# EasyEDA Pro project TC264_2024-10-17.epro

# Schematic Schematic2
Create Date: 2023-09-19; Page Name: P1; Project Name: TC264-摄像头组别-售卖; Schematic Name: Schematic2; Update Date: 2023-12-20; Add into BOM: yes; Convert to PCB: yes
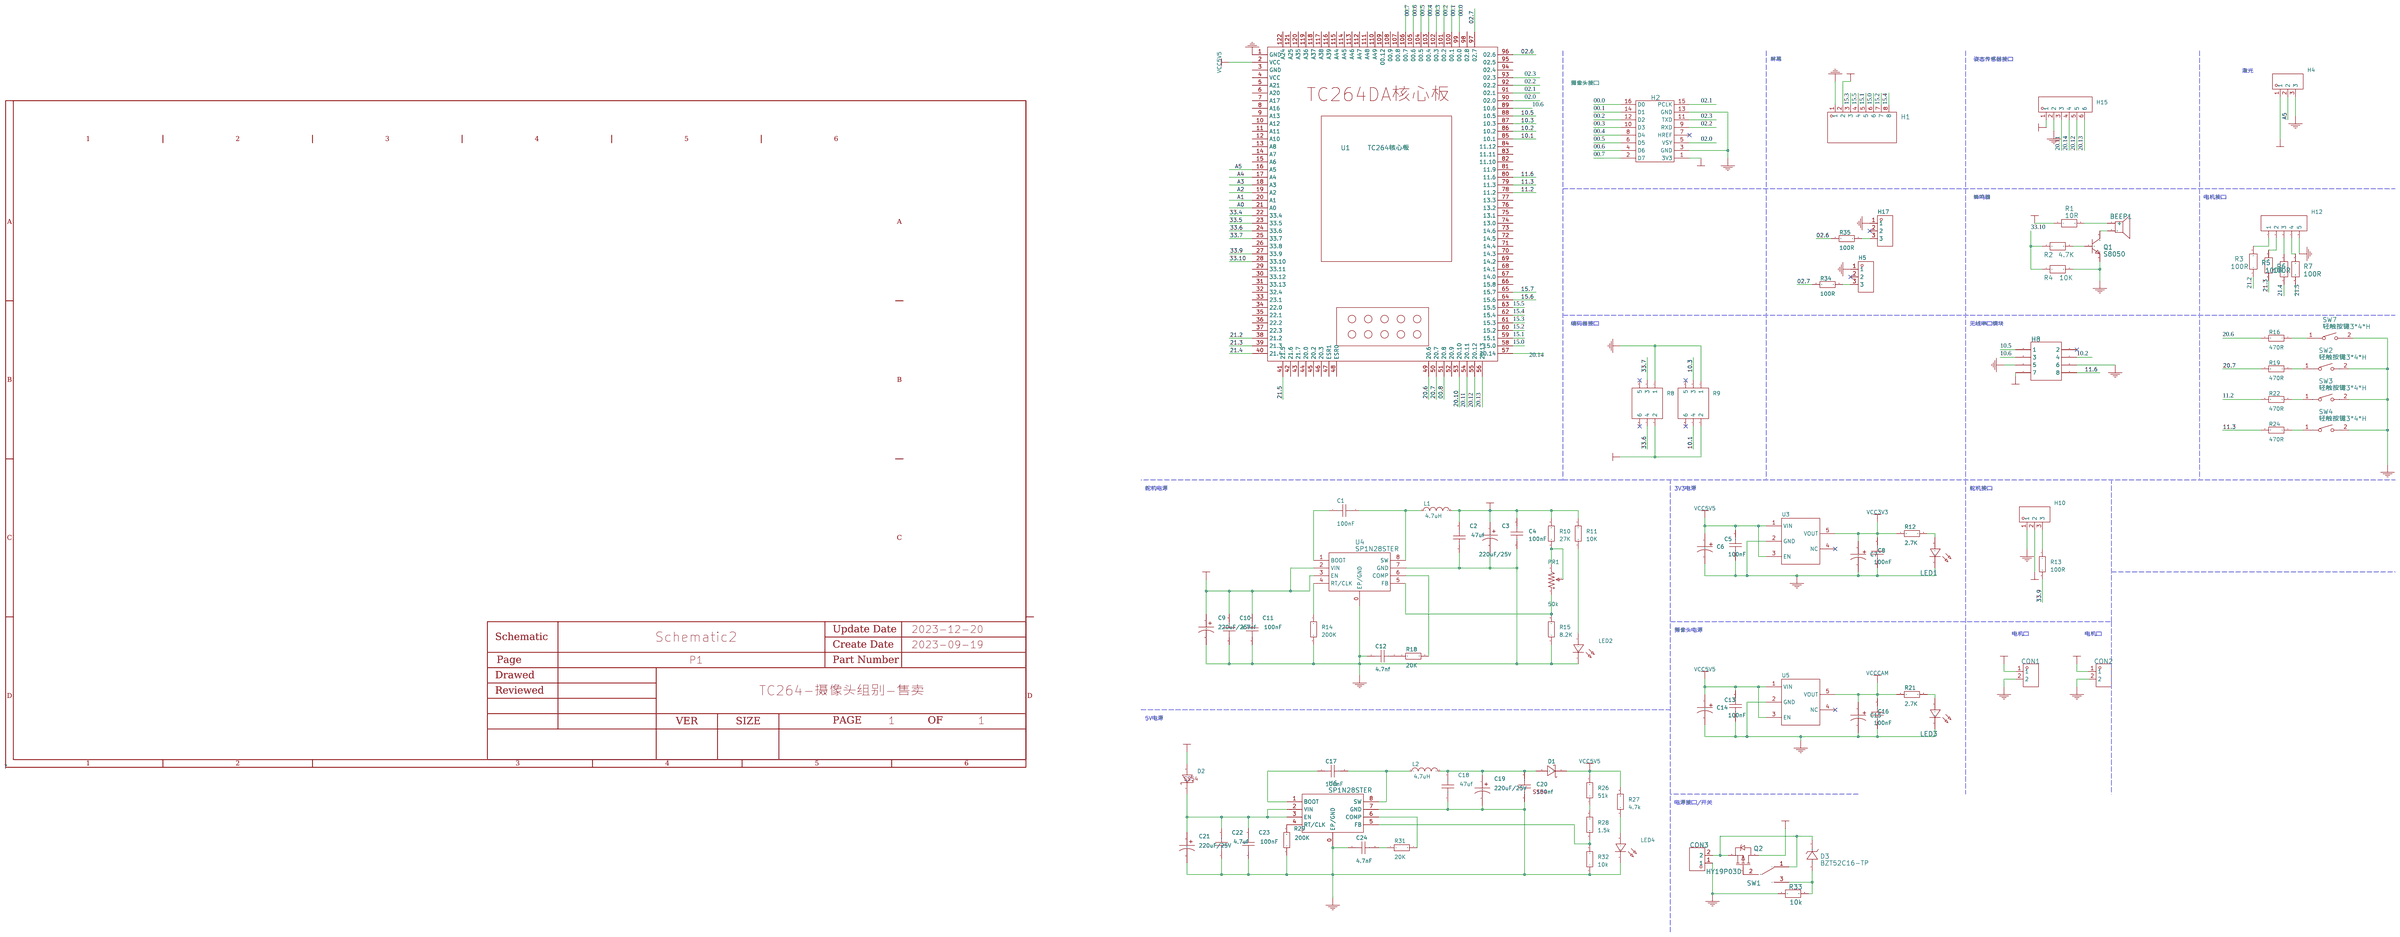
[diagram p0: schematic sheet]

## Parts
BEEP1  BEEP-9*5.5  [BEEP-9*5.5]
C1  100nF  [C0603]
C2  47uf  [C1206]
C3  220uF/25V  [CAP-TH_BD6.3-P2.50-D1.0-FD]
C4  100nF  [C0603]
C5  100nF  [C0603]
C6  F931A106MAA  [CAP-SMD_L3.2-W1.6-FD]
C7  F931A106MAA  [CAP-SMD_L3.2-W1.6-FD]
C8  100nF  [C0603]
C9  220uF/25V  [CAP-TH_BD6.3-P2.50-D1.0-FD]
C10  4.7uf  [C1206]
C11  100nF  [C0603]
C12  4.7nf  [C0603]
C13  100nF  [C0603]
C14  F931A106MAA  [CAP-SMD_L3.2-W1.6-FD]
C15  F931A106MAA  [CAP-SMD_L3.2-W1.6-FD]
C16  100nF  [C0603]
C17  100nF  [C0603]
C18  47uf  [C1206]
C19  220uF/25V  [CAP-TH_BD6.3-P2.50-D1.0-FD]
C20  100nf  [C0603]
C21  220uF/25V  [CAP-TH_BD6.3-P2.50-D1.0-FD]
C22  4.7uf  [C1206]
C23  100nF  [C0603]
C24  4.7nF  [C0603]
CON1  KF301-5.0-2P  [CONN-TH_P5.00_KF301-5.0-2P]
CON2  KF301-5.0-2P  [CONN-TH_P5.00_KF301-5.0-2P]
CON3  KF301-5.0-2P  [CONN-TH_P5.00_KF301-5.0-2P]
D1  -  [SMB_L4.3-W3.6-LS5.4-RD]
D2  -  [SMB_L4.3-W3.6-LS5.4-RD]
D3  BZT52C16-TP  [SOD-123_L2.8-W1.8-LS3.7-RD]
H1  屏幕接口  [HDR-TH_8P-P2.54-V_A2541HWV-8P]
H2  摄像头接口  [HDR-TH_16P-P2.54-V-F-R2-C8-S2.54]
H4  -  [HDR-TH_3P-P2.54-V-M]
H5  -  [HDR-TH_3P-P2.54-V-M]
H8  无线串口模块  [HDR-TH_8P-P2.54-V-F-R2-C4-S2.54-1]
H10  -  [HDR-TH_3P-P2.54-V-M]
H12  -  [HDR-TH_5P-P2.54-V-F]
H15  -  [HDR-TH_6P-P2.54-V-F]
H17  -  [HDR-TH_3P-P2.54-V-M]
L1  4.7uH  [IND-SMD_L6.8-W6.8_SMMS0630]
L2  4.7uH  [IND-SMD_L6.8-W6.8_SMMS0630]
LED1  -  [LED0805-RD_RED]
LED2  -  [LED0805-RD_RED]
LED3  -  [LED0805-RD_RED]
LED4  -  [LED0805-RD_RED]
PR1  50k  [RES-ADJ-TH_3P-L10.0-W10.0-P2.50-L]
Q1  S8050  [SOT-23-3_L2.9-W1.3-P1.90-LS2.4-BR]
Q2  HY19P03D  [TO-252-2_L6.6-W6.1-P4.57-LS9.9-TL-CW]
R1  10R  [R0603]
R2  4.7K  [R0603]
R3  100R  [R0603]
R4  10K  [R0603]
R5  100R  [R0603]
R6  100R  [R0603]
R7  100R  [R0603]
R8  100R  [HDR-F-2.54_2X3]
R9  100R  [HDR-F-2.54_2X3]
R10  27K  [R0603]
R11  10K  [R0603]
R12  2.7K  [R0603]
R13  100R  [R0603]
R14  200K  [R0603]
R15  8.2K  [R0603]
R16  470R  [R0603]
R18  20K  [R0603]
R19  470R  [R0603]
R21  2.7K  [R0603]
R22  470R  [R0603]
R24  470R  [R0603]
R26  51k  [R0603]
R27  4.7k  [R0603]
R28  1.5k  [R0603]
R29  200K  [R0603]
R31  20K  [R0603]
R32  10k  [R0603]
R33  10k  [R0603]
R34  100R  [R0603]
R35  100R  [R0603]
SW1  SS12D10  [SS12D10]
SW2  轻触按键3*4*H  [SW-SMD_L4.0-W2.9-LS5.0]
SW3  轻触按键3*4*H  [SW-SMD_L4.0-W2.9-LS5.0]
SW4  轻触按键3*4*H  [SW-SMD_L4.0-W2.9-LS5.0]
SW7  轻触按键3*4*H  [SW-SMD_L4.0-W2.9-LS5.0]
U1  TC264核心板  [TC264DA核心板封装]
U3  RT9013-33GB  [SOT-23-5_L3.0-W1.7-P0.95-LS2.8-BR]
U4  SP1N28STER  [SOP-8E]
U5  RT9013-33GB  [SOT-23-5_L3.0-W1.7-P0.95-LS2.8-BR]
U6  SP1N28STER  [SOP-8E]

## Library data of the parts
BEEP1 = BEEP-9*5.5: Supplier: LCSC; Manufacturer: HNDZ; Manufacturer Part: HMB1275-05B; Supplier Part: C96491
C1 C4 C5 C8 C11-C13 C16 C17 C20 C23 C24 = CAP_0603: 容值:100nF;精度:±10%;额定电压:50V;温度系数:X7R;; Supplier Footprint: 0603
C2 C10 C18 C22 = CAP_1206: 容值:100nF;精度:±10%;额定电压:50V;温度系数:X7R;; Supplier Footprint: 1206
C3 C9 C19 C21 = SHW1000UF6.3V6.3X11: 容值:1000uF;精度:±20%;额定电压:6.3V;电容体直径:6.3mm;电容体长度:11mm;脚间距:2.5mm;纹波电流:2A@ 100kHz;等效串联电阻:75mΩ@ 100kHz~300kHz;工作寿命:10000hrs@ 105;工作温度:-;; LCSC Part Name: 1000uF ±20% 6.3V; Supplier Part: C494544; Manufacturer: KNSCHA(科尼盛); Supplier Footprint: 径向引线,6.3x11mm; JLCPCB Part Class: Extended Part; Datasheet: https://atta.szlcsc.com/upload/public/pdf/source/20200310/C494544_07035577F4FF2E09F690DEEEB2257D7D.pdf; Supplier: LCSC; Tolerance: ±20%; Rated Voltage: 6.3V; φD: 6.3mm; L: 11mm; Lead Spacing: 2.5mm; Ripple Current: 2A@ 100kHz; Equivalent Series Resistance(ESR): 75mΩ@ 100kHz~300kHz; Lifetime @ Temp: 10000hrs@ 105
C6 C7 C14 C15 = F931A106MAA: LCSC Part Name: 钽电容; Supplier Part: C3036058; Manufacturer: Kyocera AVX; Supplier Footprint: 1206; JLCPCB Part Class: Extended Part; Datasheet: https://atta.szlcsc.com/upload/public/pdf/source/20220630/F1331143DF7C77D86A16E54E61786077.pdf; Supplier: LCSC
CON1-CON3 = KF301-5.0-2P: link: https://item.szlcsc.com/481499.html; Supplier: LCSC; Supplier Part: C474881; Manufacturer: KEFA(科发); JLCPCB Part Class: Extended Part
D1 D2 = SS54: 直流反向耐压(Vr):40V;平均整流电流(Io):5A;正向压降(Vf):550mV@5A;; LCSC Part Name: 40V 5A 550mV@5A SMB; Supplier Part: C432139; Manufacturer: LGE(鲁光); Supplier Footprint: SMB; JLCPCB Part Class: Extended Part; Datasheet: https://atta.szlcsc.com/upload/public/pdf/source/20190927/C432139_FC6DFECF64A73B31AD131A50BD145B4D.pdf; Supplier: LCSC; Reverse Voltage (Vr): 40V; Average Rectified Current (Io): 5A; Forward Voltage (Vf@If): 550mV@5A
D3 = BZT52C16-TP: link: https://item.szlcsc.com/301422.html; Supplier: LCSC; Supplier Part: C668894; Manufacturer: MCC(美微科); JLCPCB Part Class: Extended Part
H1 = 屏幕接口: link: https://item.szlcsc.com/225788.html; 3DModel: HDR2.54-F-LI-1X8P; Supplier: LCSC; Supplier Part: C225505; Manufacturer: CJT(长江连接器); Manufacturer Part: A2541HWV-8P; JLCPCB Part Class: Extended Part
H2 = 摄像头接口: link: https://item.szlcsc.com/760101.html; 3DModel: HDR-TH_16P-P2.54-F-LI-2X8P; Supplier: LCSC; Manufacturer: CONNFLY; Manufacturer Part: DS1023-2*8SF11; Supplier Part: C92267; JLCPCB Part Class: Extended Part
H4 H5 H10 H17 = HDR-M_2.54_1x3P: Supplier Part: C2937625; Supplier Footprint: 插件
H8 = 无线串口模块: link: https://lcsc.com/product-detail/Female-Header_Made-in-China-Made-in-China-Female-header-2-4P-2-54mm_C58378.html; 3DModel: HDR2.54-F-LI-2X4P; Supplier: LCSC; Manufacturer: CONNFLY; Manufacturer Part: DS1023-2*4SF11; Supplier Part: C92271; JLCPCB Part Class: Extended Part
H12 = HDR-F_2.54_1x5P: Supplier Part: C50950; Supplier Footprint: 插件
H15 = HDR-F_2.54_1x6P: Supplier Part: C40877; Supplier Footprint: 插件
L1 L2 = SMMS0630-330M: 电感值:33uH;精度:±20%;额定电流:2A;直流电阻(DCR):270mΩ;; LCSC Part Name: 33uH ±20% 2A 270mΩ; Supplier Part: C149577; Manufacturer: SXN(顺翔诺); Supplier Footprint: SMD,7.1x6.6x3mm; JLCPCB Part Class: Extended Part; Datasheet: https://atta.szlcsc.com/upload/public/pdf/source/20210810/BBF24330FB2F5029F637830BA9C42C0D.pdf; Supplier: LCSC; Tolerance: ±20%; Rated Current: 2A; DC Resistance (DCR): 270mΩ
LED1 LED3 = LED_0805-R: Supplier Footprint: 0805
LED2 LED4 = LED_0805-G: Supplier Footprint: 0805
PR1 = R_3296: 阻值:10kΩ;精度:±10%;温度系数:±250ppm/;; Supplier Footprint: 直插
Q1 = S8050: link: https://atta.szlcsc.com/upload/public/pdf/source/20220824/B5587C0668AA5FB74D008695A37D017F.pdf; 3DModel: SOT-23-3P_L2.9-W1.3-H1.0-LS2.4-P0.95; Supplier: LCSC; Supplier Part: C5143141; Manufacturer: MOT(仁懋); Manufacturer Part: S8050/J3Y/0.4; JLCPCB Part Class: Extended Part
Q2 = HY19P03D: link: https://item.szlcsc.com/176608.html; 3DModel: TO-252-2L-3P_L6.6-W6.1-H2.3-LS10.1-P4.6; Supplier: LCSC; Manufacturer: HUAYI(华羿微); Supplier Part: C122492; JLCPCB Part Class: Extended Part
R1 = 10R: 3DModel: R0603_L1.6-W0.8-H0.8; link: https://www.mouser.in/datasheet/2/447/PYu_RT_1_to_0_01_RoHS_L_11-1669912.pdf
R2 = 4.7K: 3DModel: R0603_L1.6-W0.8-H0.8; link: https://www.mouser.in/datasheet/2/447/PYu_RT_1_to_0_01_RoHS_L_11-1669912.pdf
R3 R5-R9 = 100R: 3DModel: R0603_L1.6-W0.8-H0.8; link: https://www.mouser.in/datasheet/2/447/PYu_RT_1_to_0_01_RoHS_L_11-1669912.pdf
R4 = 10K: 3DModel: R0603_L1.6-W0.8-H0.8; link: https://www.mouser.in/datasheet/2/447/PYu_RT_1_to_0_01_RoHS_L_11-1669912.pdf
R10-R16 R18 R19 R21 R22 R24 R26-R29 R31 R32 R34 R35 = Res_0603: Supplier Footprint: 0603
R33 = 1k: 3DModel: R0603_L1.6-W0.8-H0.8; link: https://www.mouser.in/datasheet/2/447/PYu_RT_1_to_0_01_RoHS_L_11-1669912.pdf
SW1 = SS12D10
SW2-SW4 SW7 = 轻触按键3*4*H: Supplier: LCSC; Supplier Part: C9900017573; Manufacturer: null; JLCPCB Part Class: Extended Part
U1 = TC264核心板
U3 U5 = RT9013-33GB: 输出类型:固定;输出极性:正;输出通道数:1;最大输入电压:5.5V;输出电压:3.3V;压差:400mV@(500mA);静态电流(地电流):-;输出电流:500mA;电源纹波抑制比(PRSS):50dB@(10kHz);噪声:-;特性:-;; LCSC Part Name: Vin=5.5V Vout=3.3V 500mA 50dB@(10kHz); Supplier Part: C47773; Manufacturer: RICHTEK(台湾立锜); Supplier Footprint: SOT-23-5; JLCPCB Part Class: Extended Part; Datasheet: https://atta.szlcsc.com/upload/public/pdf/source/20150504/1457707282459.pdf; Supplier: LCSC; Output Type: 固定; Output Polarity: 正; Number of Outputs: 1; Maximum Input Voltage: 5.5V; Output Voltage: 3.3V; Dropout Voltage: 400mV@(500mA); Output Current: 500mA; Power Supply Rejection Ratio (PRSS): 50dB@(10kHz)
U4 U6 = SP1N28STER: Revision: V1.0

## Nets
GNDBAT: C2.1 C3.2 C4.1 C5.1 C6.2 C7.2 C8.1 C9.2 C10.1 C11.1 C12.1 C13.1 C14.2 C15.2 C16.1 C18.1 C19.2 C20.1 C21.2 C22.1 C23.1 C24.1 CON1.2 CON2.2 CON3.1 H1.1 H2.3(GND) H2.13(GND) H4.3 H5.1 H8.5 H8.6 H10.1 H12.5 H15.2 H17.1 LED1.1(C) LED2.1(C) LED3.1(C) LED4.1(C) Q1.2(E) R4.2 R8.1 R9.1 R14.2 R15.1 R29.1 R32.1 R33.1 SW2.2 SW3.2 SW4.2 SW7.2 U1.1(GND) U3.2(GND) U4.0(EP/GND) U4.7(GND) U5.2(GND) U6.0(EP/GND) U6.7(GND)
VCC3V3: C7.1 C8.2 H1.2 H15.1 R1.1 R8.2 R9.2 R12.1 U3.5(VOUT)
VCC5V5: C5.2 C6.1 C13.2 C14.1 D1.1(C) H4.1 H8.7 R26.2 R27.2 U1.2(VCC) U3.1(VIN) U3.3(EN) U5.1(VIN) U5.3(EN)
VCCBAT: C9.1 C10.2 C11.2 CON1.1 CON2.1 D2.2(A) Q2.2(D) U4.2(VIN) U4.3(EN)
VCCCAM: C15.1 C16.2 H2.1(3V3) R21.1 U5.5(VOUT)
VCCSTEER: C2.2 C3.1 C4.2 H10.2 L1.2 R10.2 R11.2
00.0: H2.16(D0) U1.99(00.0)
00.1: H2.14(D1) U1.100(00.1)
00.2: H2.12(D2) U1.101(00.2)
00.3: H2.10(D3) U1.102(00.3)
00.4: H2.8(D4) U1.103(00.4)
00.5: H2.6(D5) U1.104(00.5)
00.6: H2.4(D6) U1.105(00.6)
00.7: H2.2(D7) U1.106(00.7)
00.8: U1.51(20.8)
02.0: H2.5(VSY) U1.90(02.0)
02.1: H2.15(PCLK) U1.91(02.1)
02.2: H2.9(RXD) U1.92(02.2)
02.3: H2.11(TXD) U1.93(02.3)
02.6: R35.2 U1.96(02.6)
02.7: R34.2 U1.97(02.7)
10.1: R9.4 U1.85(10.1)
10.2: H8.4 U1.86(10.2)
10.3: R9.3 U1.87(10.3)
10.5: H8.1 U1.88(10.5)
10.6: H8.3 U1.89(10.6)
11.2: R22.2 U1.78(11.2)
11.3: R24.2 U1.79(11.3)
11.6: H8.8 U1.80(11.6)
15.0: H1.6 U1.58(15.0)
15.1: H1.5 U1.59(15.1)
15.2: H1.7 U1.60(15.2)
15.3: H1.3 U1.61(15.3)
15.4: H1.8 U1.62(15.4)
15.5: H1.4 U1.63(15.5)
15.6: U1.64(15.6)
15.7: U1.65(15.7)
20.6: R16.2 U1.49(20.6)
20.7: R19.2 U1.50(20.7)
20.10: U1.53(20.10)
20.11: H15.3 U1.54(20.11)
20.12: H15.5 U1.55(20.12)
20.13: H15.6 U1.56(20.13)
20.14: H15.4 U1.57(20.14)
21.2: R3.1 U1.38(21.2)
21.3: R5.2 U1.39(21.3)
21.4: R6.1 U1.40(21.4)
21.5: R7.2 U1.41(21.5)
33.4: U1.22(33.4)
33.5: U1.23(33.5)
33.6: R8.4 U1.24(33.6)
33.7: R8.3 U1.25(33.7)
33.9: R13.2 U1.27(33.9)
33.10: R2.1 R4.1 U1.28(33.10)
A0: U1.21(A0)
A1: U1.20(A1)
A2: U1.19(A2)
A3: U1.18(A3)
A4: U1.17(A4)
A5: H4.2 U1.16(A5)
$1N29869: H12.3 R6.2
$1N29872: H12.1 R3.2
$1N29873: H12.2 R5.1
$1N29874: H12.4 R7.1
$1N29879: BEEP1.1(+) R1.2
$1N29880: BEEP1.2 Q1.3(C)
$1N29881: Q1.1(B) R2.2
$1N29892: H10.3 R13.1
$1N29897: LED3.2(A) R21.2
$1N29902: LED1.2(A) R12.2
$1N29905: Q2.1(G) SW1.2
$1N29906: D3.2(A) R33.2 SW1.3
$1N29908: R29.2 U6.4(RT/CLK)
$1N29909: C17.1 U6.1(BOOT)
$1N29910: C17.2 L2.1 U6.8(SW)
$1N29911: R31.2 U6.6(COMP)
$1N29912: C24.2 R31.1
$1N29913: R26.1 R28.2
$1N29914: LED4.2(A) R27.1
$1N29916: C18.2 C19.1 C20.2 D1.2(A) L2.2
$1N29918: R28.1 R32.2 U6.5(FB)
$1N29920: C21.1 C22.2 C23.2 D2.1(C) U6.2(VIN) U6.3(EN)
$1N29921: C12.2 R18.1
$1N29922: LED2.2(A) R11.1
$1N29924: PR1.2 PR1.3 R10.1
$1N29926: PR1.1 R15.2 U4.5(FB)
$1N29927: C1.2 L1.1 U4.8(SW)
$1N29928: C1.1 U4.1(BOOT)
$1N29929: R18.2 U4.6(COMP)
$1N29930: R14.1 U4.4(RT/CLK)
$1N29955: CON3.2 D3.1(C) Q2.3(S) SW1.1
$1N29989: R16.1 SW7.1
$1N29991: R19.1 SW2.1
$1N29992: R22.1 SW3.1
$1N29994: R24.1 SW4.1
$1N51563: H17.3 R35.1
$1N51564: H5.3 R34.1

Not connected (* = marked no-connect by the designer): H2 7(HREF)*; H5 2*; H8 2*; H17 2*; R8 5* 6*; R9 5* 6*; U1 3(GND) 4(VCC) 5(A21) 6(A20) 7(A17) 8(A16) 9(A13) 10(A12) 11(A11) 12(A10) 13(A8) 14(A7) 15(A6) 26(33.8) 29(33.11) 30(33.12) 31(33.13) 32(32.4) 33(23.1) 34(22.0) 35(22.1) 36(22.2) 37(22.3) 42(21.6) 43(21.7) 44(20.0) 45(20.2) 46(20.3) 47(ESR1) 48(ESR0) 52(20.9) 66(15.8) 67(14.0) 68(14.1) 69(14.2) 70(14.3) 71(14.4) 72(14.5) 73(14.6) 74(13.0) 75(13.1) 76(13.2) 77(13.3) 81(11.9) 82(11.10) 83(11.11) 84(11.12) 94(02.4) 95(02.5) 98(02.8) 107(00.8) 108(00.9) 109(00.12) 110(A49) 111(A48) 112(A47) 113(A46) 114(A45) 115(A44) 116(A39) 117(A38) 118(A37) 119(A36) 120(A35) 121(A25) 122(A24); U3 4(NC)*; U5 4(NC)*

## Notes on the sheet
- 屏幕
- 姿态传感器接口
- 激光
- 蜂鸣器
- 电机接口
- 编码器接口
- 无线串口模块
- 舵机电源
- 3V3电源
- 舵机接口
- 摄像头电源
- 电机口
- 电机口
- 5V电源
- 电源接口/开关

# Board PCB5
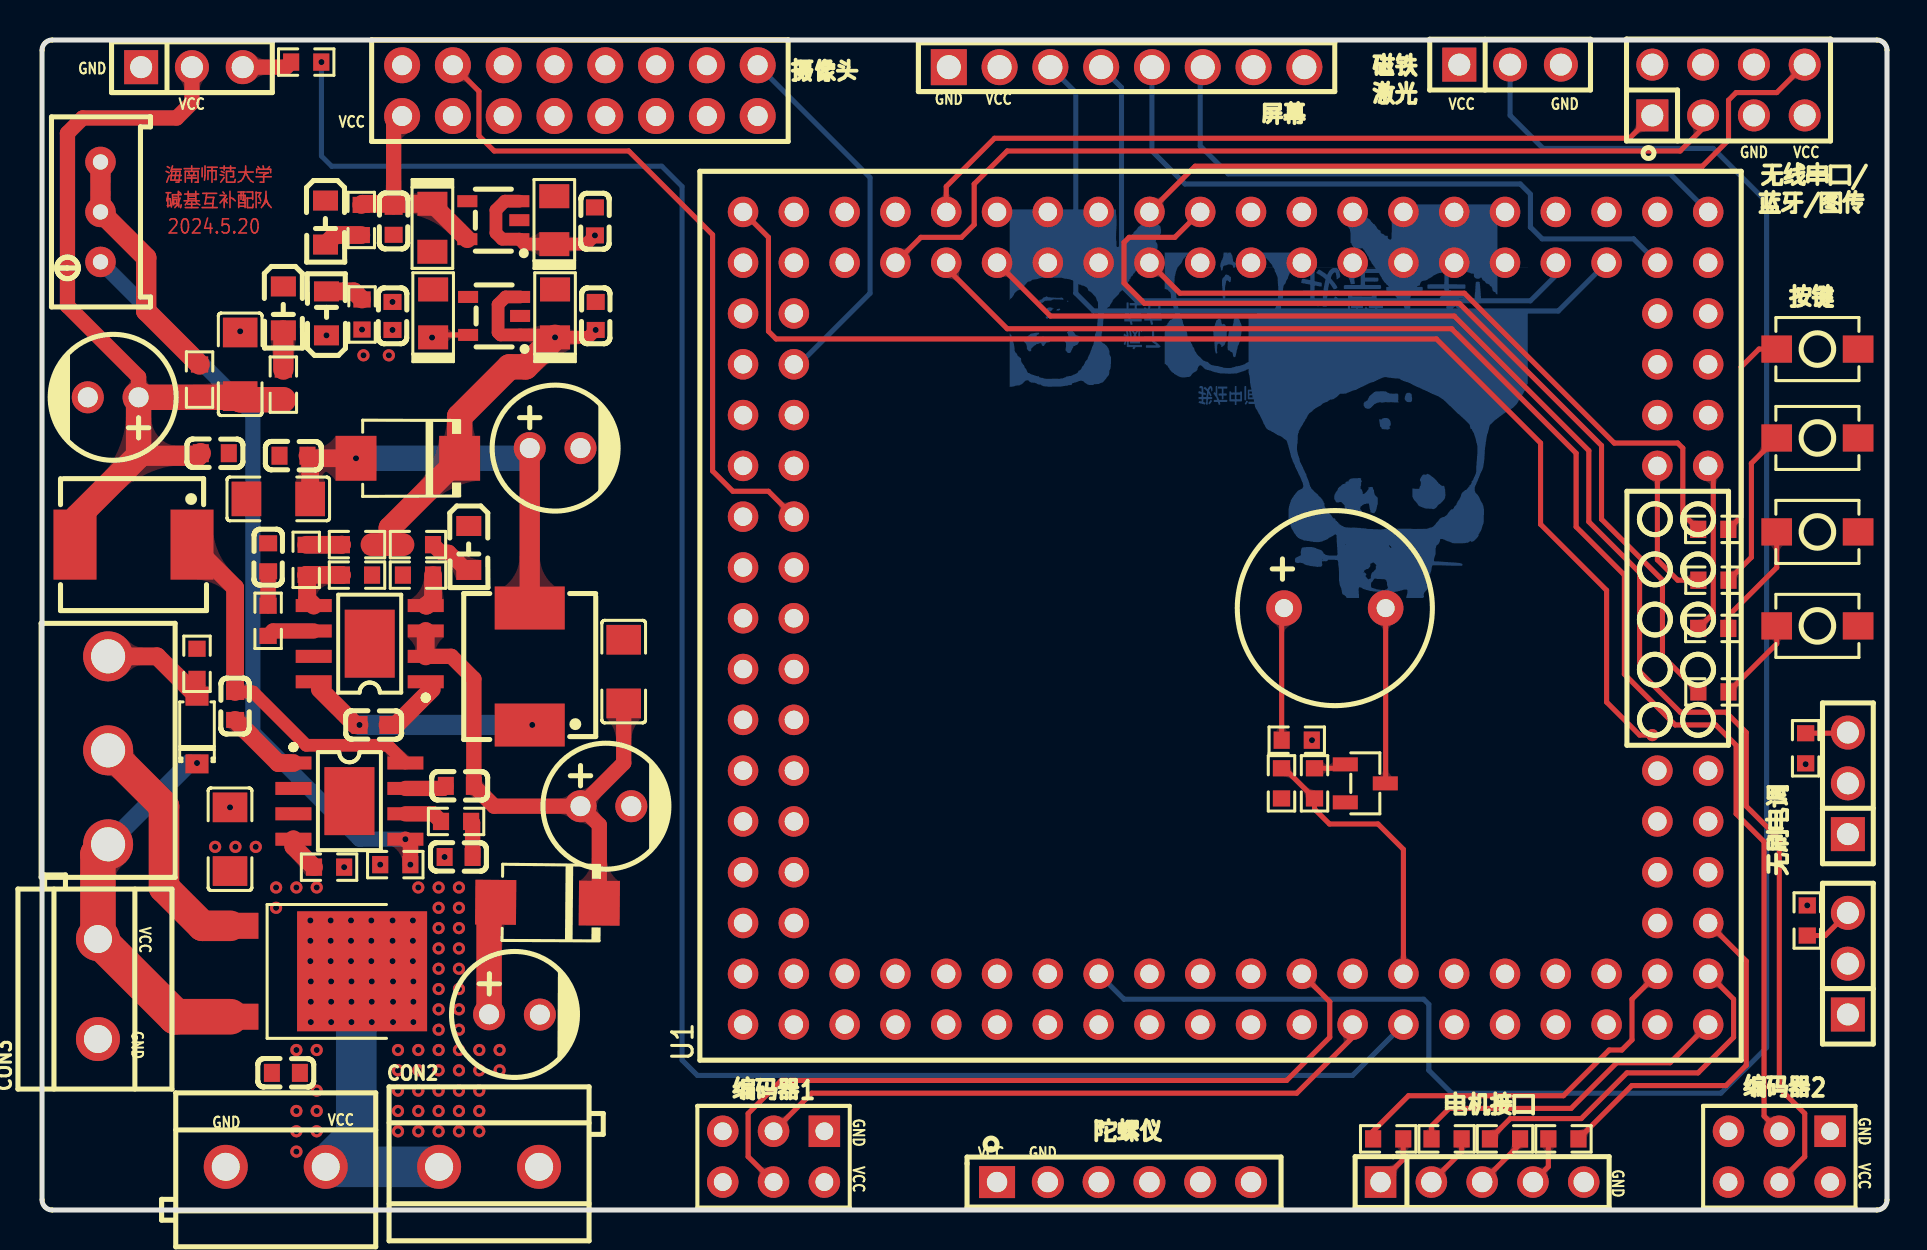
[diagram p1: board, top side]
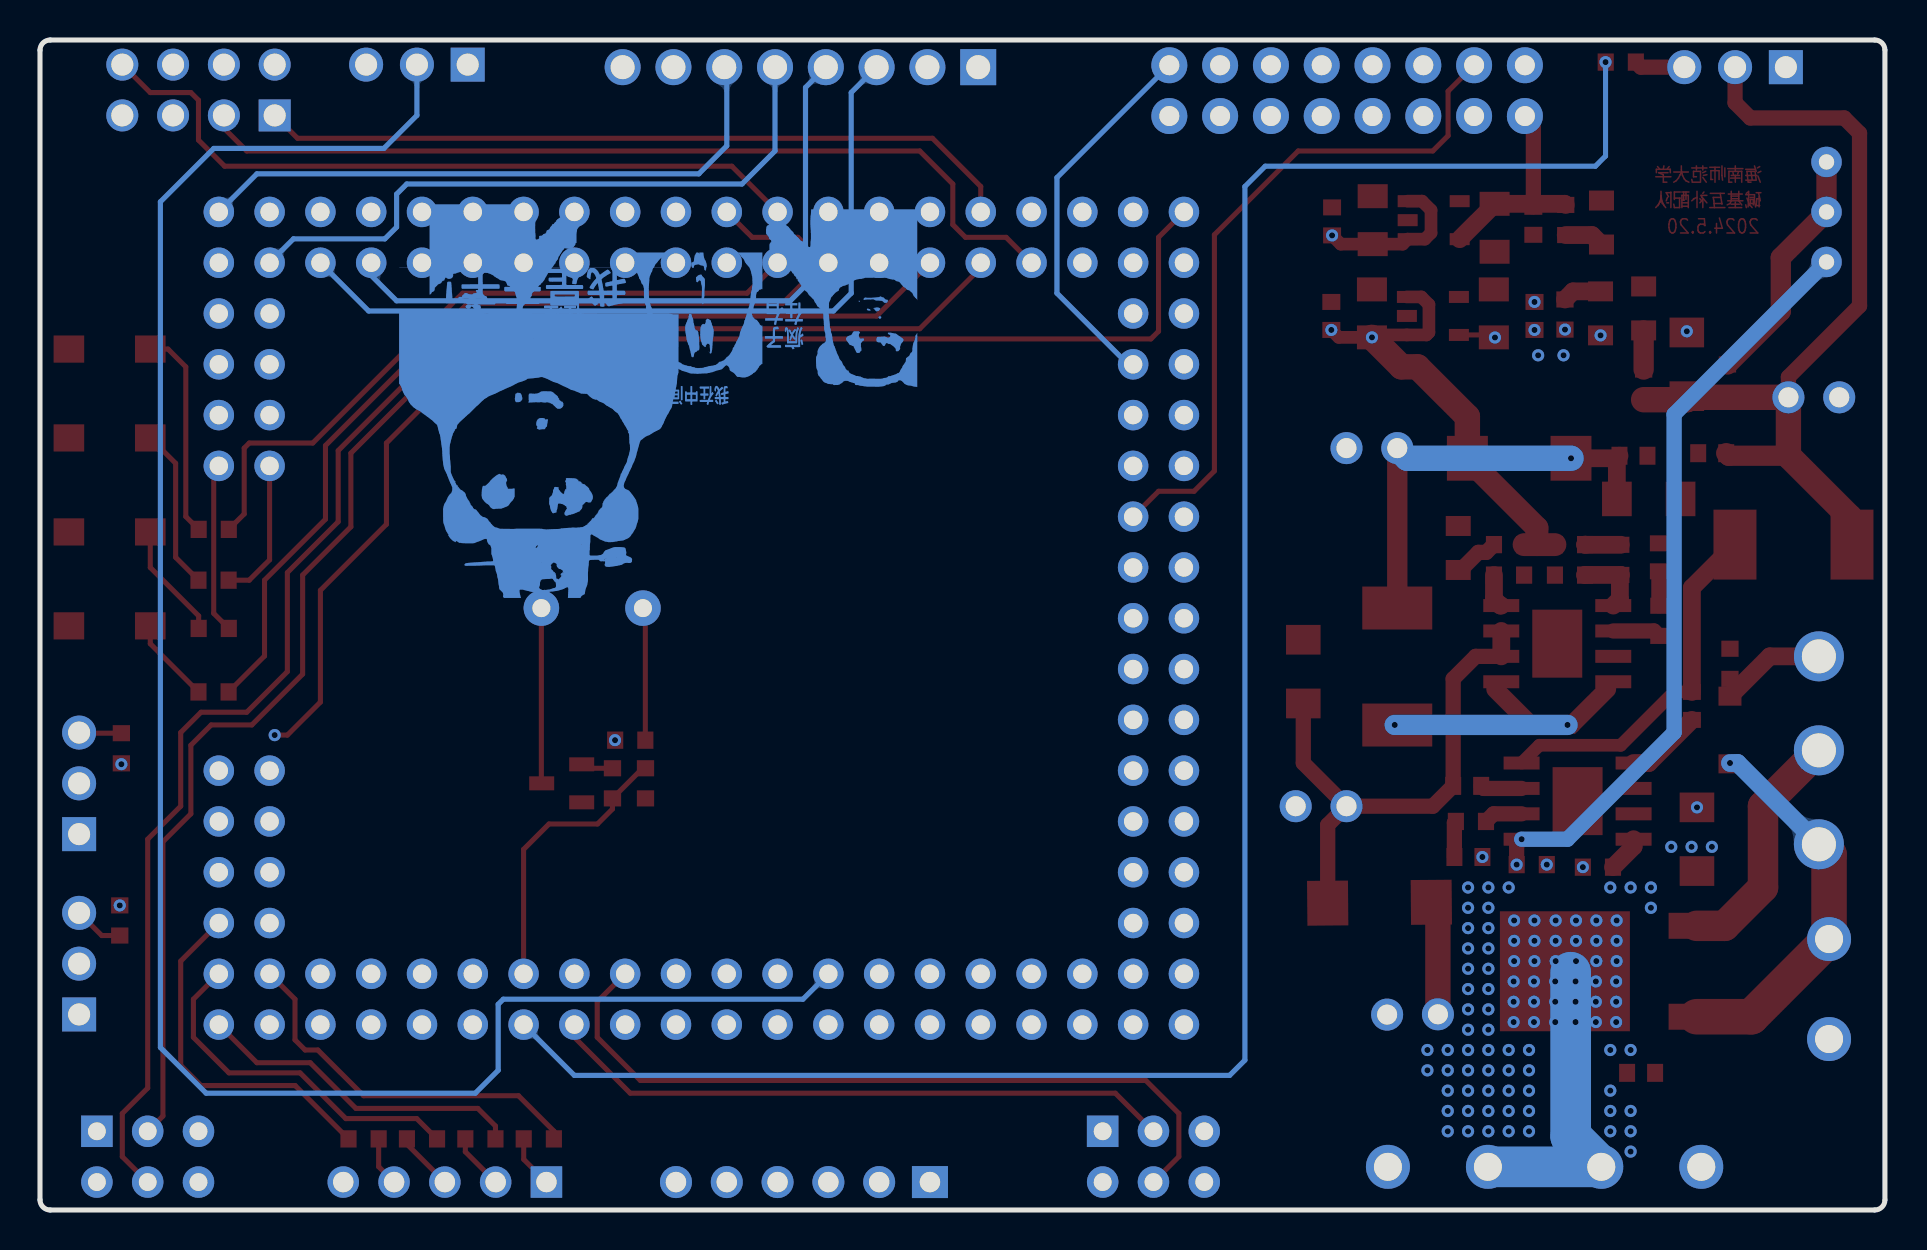
[diagram p2: board, bottom side, seen from below]

Outline 92.25 x 58.51 mm; copper layers: Top Layer, Inner1, Inner2, Bottom Layer. Coordinates in mm from the lower left corner of the outline.
Outline path: 0,58 0,0.51 arc(0.15,0.15) 0.51,0 91.75,0 arc(92.1,0.15) 92.25,0.51 92.25,58 arc(92.1,58.36) 91.75,58.51 0.51,58.51 arc(0.15,58.36) 0,58
Stack: Top Layer 0.035mm / Dielectric1 0.48mm PP er 4.5 / Inner1 0.035mm / Dielectric2 0.48mm FR4 er 4.5 / Inner2 0.035mm / Dielectric3 0.48mm PP er 4.5 / Bottom Layer 0.035mm

## Design rules (mm)
spacing safeClearance (default): track to track 0.152, other pairs 0.152 to 0.3
track width trackWidth (default): min 0.127, default 0.254, max 2.54
differential pair differentialPair (default): width min 0.127, default 0.254, max 2.54; gap min 0.152, default 0.152
via viaSize (default): diameter min 0.5, default 0.61, max 10; hole min 0.3, default 0.305, max 6

## Placement (name value [footprint] x y rotation side)
BEEP1  -  [BEEP-9*5.5]  64.64 30.1 0 top
C1  100nF  [C0603]  9.65 25.21 90 top
C2  47uf  [C1206]  9.91 42.29 270 top
C3  220uF/25V  [CAP-TH_BD6.3-P2.50-D1.0-FD]  3.56 40.64 180 top
C4  100nF  [C0603]  8.64 37.85 180 top
C5  100nF  [C0603]  27.68 44.71 270 top
C6  F931A106MAA  [CAP-SMD_L3.2-W1.6-FD]  25.65 44.84 90 top
C7  F931A106MAA  [CAP-SMD_L3.2-W1.6-FD]  19.55 44.84 90 top
C8  100nF  [C0603]  17.52 44.71 270 top
C9  220uF/25V  [CAP-TH_BD6.3-P2.50-D1.0-FD]  23.62 9.78 359.7 top
C10  4.7uf  [C1206]  9.4 18.54 270 top
C11  100nF  [C0603]  12.19 6.86 0 top
C12  4.7nf  [C0603]  20.83 17.65 0 top
C13  100nF  [C0603]  27.64 49.44 270 top
C14  F931A106MAA  [CAP-SMD_L3.2-W1.6-FD]  25.61 49.5 90 top
C15  F931A106MAA  [CAP-SMD_L3.2-W1.6-FD]  19.52 49.12 270 top
C16  100nF  [C0603]  17.58 49.47 90 top
C17  100nF  [C0603]  16.57 24.26 180 top
C18  47uf  [C1206]  11.81 35.56 0 top
C19  220uF/25V  [CAP-TH_BD6.3-P2.50-D1.0-FD]  25.65 38.1 0 top
C20  100nf  [C0603]  12.57 37.72 0 top
C21  220uF/25V  [CAP-TH_BD6.3-P2.50-D1.0-FD]  28.19 20.19 0 top
C22  4.7uf  [C1206]  29.08 26.92 270 top
C23  100nF  [C0603]  20.89 21.21 0 top
C24  4.7nF  [C0603]  11.3 32.64 270 top
CON1  KF301-5.0-2P  [CONN-TH_P5.00_KF301-5.0-2P]  11.68 2.16 180 top
CON2  KF301-5.0-2P  [CONN-TH_P5.00_KF301-5.0-2P]  22.35 2.16 0 top
CON3  KF301-5.0-2P  [CONN-TH_P5.00_KF301-5.0-2P]  2.79 11.05 90 top
D1  -  [SMB_L4.3-W3.6-LS5.4-RD]  18.29 37.59 180 top
D2  -  [SMB_L4.3-W3.6-LS5.4-RD]  25.27 15.37 179.5 top
D3  BZT52C16-TP  [SOD-123_L2.8-W1.8-LS3.7-RD]  7.75 24 90 top
H1  屏幕接口  [HDR-TH_8P-P2.54-V_A2541HWV-8P]  54.23 57.15 0 top
H2  摄像头接口  [HDR-TH_16P-P2.54-V-F-R2-C8-S2.54]  26.89 55.98 0 top
H4  -  [HDR-TH_3P-P2.54-V-M]  73.41 57.28 0 top
H5  -  [HDR-TH_3P-P2.54-V-M]  90.3 12.32 90 top
H8  无线串口模块  [HDR-TH_8P-P2.54-V-F-R2-C4-S2.54-1]  84.33 56.01 0 top
H10  -  [HDR-TH_3P-P2.54-V-M]  7.49 57.15 0 top
H12  -  [HDR-TH_5P-P2.54-V-F]  72.01 1.4 0 top
H15  -  [HDR-TH_6P-P2.54-V-F]  54.1 1.4 0 top
H17  -  [HDR-TH_3P-P2.54-V-M]  90.3 21.34 90 top
L1  4.7uH  [IND-SMD_L6.8-W6.8_SMMS0630]  4.57 33.27 180 top
L2  4.7uH  [IND-SMD_L6.8-W6.8_SMMS0630]  24.38 27.18 90 top
LED1  -  [LED0805-RD_RED]  14.22 44.84 90 top
LED2  -  [LED0805-RD_RED]  12.07 45.09 270 top
LED3  -  [LED0805-RD_RED]  14.17 49.38 270 top
LED4  -  [LED0805-RD_RED]  21.34 33.11 270 top
PR1  50k  [RES-ADJ-TH_3P-L10.0-W10.0-P2.50-L]  2.92 49.91 90 top
Q1  S8050  [SOT-23-3_L2.9-W1.3-P1.90-LS2.4-BR]  66.17 21.34 180 top
Q2  HY19P03D  [TO-252-2_L6.6-W6.1-P4.57-LS9.9-TL-CW]  12.71 11.94 0 top
R1  10R  [R0603]  62.74 23.5 180 top
R2  4.7K  [R0603]  63.63 21.34 90 top
R3  100R  [R0603]  67.31 3.56 0 top
R4  10K  [R0603]  61.98 21.34 270 top
R5  100R  [R0603]  70.23 3.56 180 top
R6  100R  [R0603]  73.15 3.56 0 top
R7  100R  [R0603]  76.07 3.56 0 top
R8  100R  [HDR-F-2.54_2X3]  36.58 2.67 180 top
R9  100R  [HDR-F-2.54_2X3]  86.87 2.67 180 top
R10  27K  [R0603]  7.87 41.53 270 top
R11  10K  [R0603]  12.07 41.28 270 top
R12  2.7K  [R0603]  16 44.78 90 top
R13  100R  [R0603]  13.21 57.4 0 top
R14  200K  [R0603]  14.35 17.15 0 top
R15  8.2K  [R0603]  17.66 17.27 0 top
R16  470R  [R0603]  83.57 31.5 180 top
R18  20K  [R0603]  20.7 19.43 180 top
R19  470R  [R0603]  83.57 29.08 180 top
R21  2.7K  [R0603]  15.96 49.51 270 top
R22  470R  [R0603]  83.57 25.91 180 top
R24  470R  [R0603]  83.57 34.04 180 top
R26  51k  [R0603]  15.75 33.27 0 top
R27  4.7k  [R0603]  18.8 33.27 180 top
R28  1.5k  [R0603]  13.21 32.51 90 top
R29  200K  [R0603]  18.8 31.75 0 top
R31  20K  [R0603]  11.3 29.46 270 top
R32  10k  [R0603]  15.75 31.75 180 top
R33  10k  [R0603]  7.75 27.31 270 top
R34  100R  [R0603]  88.27 14.48 90 top
R35  100R  [R0603]  88.18 23.09 270 top
SW1  -  [SS12D10]  3.3 22.99 90 top
SW2  轻触按键3*4*H  [SW-SMD_L4.0-W2.9-LS5.0]  88.77 33.91 0 top
SW3  轻触按键3*4*H  [SW-SMD_L4.0-W2.9-LS5.0]  88.77 29.21 0 top
SW4  轻触按键3*4*H  [SW-SMD_L4.0-W2.9-LS5.0]  88.77 43.05 0 top
SW7  轻触按键3*4*H  [SW-SMD_L4.0-W2.9-LS5.0]  88.77 38.61 0 top
U1  TC264核心板  [TC264DA核心板封装]  57.53 29.59 90 top
U3  RT9013-33GB  [SOT-23-5_L3.0-W1.7-P0.95-LS2.8-BR]  22.6 44.71 0 top
U4  SP1N28STER  [SOP-8E]  15.37 20.45 0 top
U5  RT9013-33GB  [SOT-23-5_L3.0-W1.7-P0.95-LS2.8-BR]  22.56 49.5 0 top
U6  SP1N28STER  [SOP-8E]  16.38 28.32 180 top

## Footprints (pads in the part's own frame, mm; a bottom-side part is the same pattern mirrored in y, then rotated)
BEEP-9*5.5
  round 1.778 hole 0.899: 1(-2.54,-0.001) 2(2.54,-0.001)
C0603
  rect 0.8x0.9 smd: 1(-0.7,0) 2(0.7,0)
C1206
  rect 1.485x1.728 smd: 1(-1.593,0) 2(1.593,0)
CAP-SMD_L3.2-W1.6-FD
  rect 1.199x1.501 smd: 1(-1.199,0) 2(1.199,0)
CAP-TH_BD6.3-P2.50-D1.0-FD
  round 1.6 hole 1: 1(-1.27,0) 2(1.27,0)
CONN-TH_P5.00_KF301-5.0-2P
  round 2.2 hole 1.4: 1(-2.5,0) 2(2.5,0)
HDR-F-2.54_2X3
  rect 1.575x1.575 hole 0.889: 1(-2.54,-1.27)
  round 1.575 hole 0.889: 2(-2.54,1.27) 3(0,-1.27) 4(0,1.27) 5(2.54,-1.27) 6(2.54,1.27)
HDR-TH_3P-P2.54-V-M
  rect 1.7x1.7 hole 1.1: 1(-2.54,0)
  round 1.7 hole 1.1: 2(0,0) 3(2.54,0)
HDR-TH_5P-P2.54-V-F
  rect 1.575x1.575 hole 1.02: 1(-5.08,0)
  round 1.575 hole 1.02: 2(-2.54,0) 3(0,0) 4(2.54,0) 5(5.08,0)
HDR-TH_6P-P2.54-V-F
  rect 1.8x1.6 hole 1.02: 1(-6.35,0)
  round 1.6 hole 1.02: 2(-3.81,0) 3(-1.27,0) 4(1.27,0) 5(3.81,0) 6(6.35,0)
HDR-TH_8P-P2.54-V-F-R2-C4-S2.54-1
  rect 1.6x1.6 hole 1.1: 1(-3.81,-1.27)
  round 1.6 hole 1.1: 2(-3.81,1.27) 3(-1.27,-1.27) 4(-1.27,1.27) 5(1.27,-1.27) 6(1.27,1.27) 7(3.81,-1.27) 8(3.81,1.27)
HDR-TH_8P-P2.54-V_A2541HWV-8P
  rect 1.8x1.8 hole 1.2: 1(-8.89,0)
  round 1.8 hole 1.2: 2(-6.35,0) 3(-3.81,0) 4(-1.27,0) 5(1.27,0) 6(3.81,0) 7(6.35,0) 8(8.89,0)
HDR-TH_16P-P2.54-V-F-R2-C8-S2.54
  round 1.8 hole 1: 1(-8.89,-1.27) 2(-8.89,1.27) 3(-6.35,-1.27) 4(-6.35,1.27) 5(-3.81,-1.27) 6(-3.81,1.27) 7(-1.27,-1.27) 8(-1.27,1.27) 9(1.27,-1.27) 10(1.27,1.27) 11(3.81,-1.27) 12(3.81,1.27) 13(6.35,-1.27) 14(6.35,1.27) 15(8.89,-1.27) 16(8.89,1.27)
IND-SMD_L6.8-W6.8_SMMS0630
  rect 2.149x3.5 smd: 1(-2.926,0) 2(2.926,0)
LED0805-RD_RED
  rect 1x1.25 smd: 1(-1.1,0) 2(1.1,0)
R0603
  rect 0.806x0.864 smd: 1(-0.753,0) 2(0.753,0)
RES-ADJ-TH_3P-L10.0-W10.0-P2.50-L
  round 1.524 hole 0.762: 1(-2.499,0) 2(0,0) 3(2.499,0)
SMB_L4.3-W3.6-LS5.4-RD
  rect 2.047x2.241 smd: 1(-2.591,0) 2(2.591,0)
SOD-123_L2.8-W1.8-LS3.7-RD
  rect 0.95x1.15 smd: 1(-1.692,0) 2(1.692,0)
SOP-8E
  rect 2.5x3.4 smd: 0(0,0)
  rect 1.8x0.65 smd: 1(-2.8,1.905) 2(-2.8,0.635) 3(-2.8,-0.635) 4(-2.8,-1.905) 5(2.8,-1.905) 6(2.8,-0.635) 7(2.8,0.635) 8(2.8,1.905)
SOT-23-3_L2.9-W1.3-P1.90-LS2.4-BR
  rect 1.25x0.7 smd: 1(1,-0.95) 2(1,0.95) 3(-1,0)
SOT-23-5_L3.0-W1.7-P0.95-LS2.8-BR
  rect 1x0.6 smd: 1(1.3,-0.95) 2(1.3,0) 3(1.3,0.95) 4(-1.3,0.95) 5(-1.3,-0.95)
SS12D10
  round 2.5 hole 1.7: 1(-4.7,0) 2(0,0) 3(4.7,0)
SW-SMD_L4.0-W2.9-LS5.0
  rect 1.53x1.36 smd: 1(-2.035,0) 2(2.035,0)
TC264DA核心板封装
  round 1.524 hole 0.919x0.914: 1(-20.32,22.479) 2(-17.78,22.479) 3(-20.32,19.939) 4(-17.78,19.939) 5(-20.32,17.399) 6(-17.78,17.399) 7(-20.32,14.859) 8(-17.78,14.859) 9(-20.32,12.319) 10(-17.78,12.319) 11(-20.32,9.779) 12(-17.78,9.779) 13(-20.32,7.239) 14(-17.78,7.239) 15(-20.32,4.699) 16(-17.78,4.699) 17(-20.32,2.159) 18(-17.78,2.159) 19(-20.32,-0.381) 20(-17.78,-0.381) 21(-20.32,-2.921) 22(-17.78,-2.921) 23(-20.32,-5.461) 24(-17.78,-5.461) 25(-20.32,-8.001) 26(-17.78,-8.001) 27(-20.32,-10.541) 28(-17.78,-10.541) 29(-20.32,-13.081) 30(-17.78,-13.081) 31(-20.32,-15.621) 32(-17.78,-15.621) 33(-20.32,-18.161) 34(-17.78,-18.161) 35(-20.32,-20.701) 36(-17.78,-20.701) 37(-20.32,-23.241) 38(-17.78,-23.241) 39(-20.32,-25.781) 40(-17.78,-25.781) 41(-15.24,-25.781) 42(-15.24,-23.241) 43(-12.7,-25.781) 44(-12.7,-23.241) 45(-10.16,-25.781) 46(-10.16,-23.241) 47(-7.62,-25.781) 48(-7.62,-23.241) 49(7.62,-23.241) 50(7.62,-25.781) 51(10.16,-23.241) 52(10.16,-25.781) 53(12.7,-23.241) 54(12.7,-25.781) 55(15.24,-23.241) 56(15.24,-25.781) 57(17.78,-25.781) 58(20.32,-25.781) 59(17.78,-23.241) 60(20.32,-23.241) 61(17.78,-20.701) 62(20.32,-20.701) 63(17.78,-18.161) 64(20.32,-18.161) 65(17.78,-15.621) 66(20.32,-15.621) 67(17.78,-13.081) 68(20.32,-13.081) 69(17.78,-10.541) 70(20.32,-10.541) 71(17.78,-8.001) 72(20.32,-8.001) 73(17.78,-5.461) 74(20.32,-5.461) 75(17.78,-2.921) 76(20.32,-2.921) 77(17.78,-0.381) 78(20.32,-0.381) 79(17.78,2.159) 80(20.32,2.159) 81(17.78,4.699) 82(20.32,4.699) 83(17.78,7.239) 84(20.32,7.239) 85(17.78,9.779) 86(20.32,9.779) 87(17.78,12.319) 88(20.32,12.319) 89(17.78,14.859) 90(20.32,14.859) 91(17.78,17.399) 92(20.32,17.399) 93(17.78,19.939) 94(20.32,19.939) 95(17.78,22.479) 96(20.32,22.479) 97(15.24,19.939) 98(15.24,22.479) 99(12.7,19.939) 100(12.7,22.479) 101(10.16,19.939) 102(10.16,22.479) 103(7.62,19.939) 104(7.62,22.479) 105(5.08,19.939) 106(5.08,22.479) 107(2.54,19.939) 108(2.54,22.479) 109(0,19.939) 110(0,22.479) 111(-2.54,19.939) 112(-2.54,22.479) 113(-5.08,19.939) 114(-5.08,22.479) 115(-7.62,19.939) 116(-7.62,22.479) 117(-10.16,19.939) 118(-10.16,22.479) 119(-12.7,19.939) 120(-12.7,22.479) 121(-15.24,19.939) 122(-15.24,22.479)
TO-252-2_L6.6-W6.1-P4.57-LS9.9-TL-CW
  rect 2.8x1.3 smd: 1(-3.292,2.273) 3(-3.292,-2.273)
  rect 6.5x6 smd: 2(3.292,0)

## Nets
As in the schematic.

Pads without a net: H2 7; H5 2; H8 2; H17 2; R8 5 6; R9 5 6; U1 3 4 5 6 7 8 9 10 11 12 13 14 15 26 29 30 31 32 33 34 35 36 37 42 43 44 45 46 47 48 52 66 67 68 69 70 71 72 73 74 75 76 77 81 82 83 84 94 95 98 107 108 109 110 111 112 113 114 115 116 117 118 119 120 121 122; U3 4; U5 4

## Via types
v1: diameter 0.61, hole 0.305, Top Layer to Bottom Layer, 121 vias

## Routing (per net, layer and track width the routed paths; a pad name or vN(x,y) marks a point on that pad's centre or on a via; arc(x,y) is an arc through that point)
GNDBAT: length 2.1
  Top Layer w0.762: 20.19,21.21 20.06,21.08 U4.7
  vias: v1(9.4,20.13) v1(9.91,43.94) v1(14.22,43.74) v1(15.1,17.15) v1(16.91,17.27) v1(17.52,45.41) v1(20.13,17.65)
VCC3V3: length 1.8
  Top Layer w0.254: U3.5 19.68,43.76 19.55,43.64
  vias: v1(16,44.03) v1(16.07,42.74) v1(17.34,42.74) v1(17.52,44.01) v1(19.5,43.63) v1(63.5,23.5)
VCC5V5: length 31.3
  Top Layer w0.635: U3.3 23.18,45.66 22.8,45.28 22.8,43.88 22.93,43.76 U3.1 25.53,43.76 ; v1(25.65,43.64) 27.31,43.64 v1(27.68,44.01) ; v1(27.64,48.74) 27.21,48.3 C14.1 24.11,48.3 U5.1 23.01,48.55 22.7,48.86 22.7,50 23.14,50.45 U5.3
  Top Layer w1.143: 17.4,33.27 17.4,34.11 D1.1 ; 17.4,33.27 R27.2 ; 17.4,33.27 R26.2
  Top Layer w1.27: v1(25.65,43.64) 24.18,42.16 23.37,42.16 20.88,39.68 D1.1
VCCBAT: length 21.7
  Top Layer w1.27: 22.68,15.39 22.72,15.35 22.35,14.99 22.35,9.91
  Bottom Layer w2.032: CON2.1 CON1.1 15.71,3.69 15.71,11.89
  vias: v1(8.65,18.16) v1(9.67,18.16) v1(10.69,18.16) v1(11.7,16.13) v1(11.7,15.11) v1(12.72,16.13) v1(12.72,8) v1(12.72,4.95) v1(12.72,3.94) v1(12.72,2.92) v1(13.42,14.48) v1(13.42,13.46) v1(13.42,12.45) v1(13.44,11.43) v1(13.44,10.41) v1(13.44,9.4) v1(13.73,16.13) v1(13.73,8) v1(13.73,5.97) v1(13.73,4.95) v1(13.73,3.94) v1(14.43,14.48) v1(14.43,13.46) v1(14.43,12.45) v1(14.45,11.43) v1(14.45,10.41) v1(14.45,9.4) v1(15.45,14.48) v1(15.45,13.46) v1(15.45,12.45) v1(15.47,11.43) v1(15.47,10.41) v1(15.47,9.4) v1(16.46,14.48) v1(16.46,13.46) v1(16.46,12.45) v1(16.49,11.43) v1(16.49,10.41) v1(16.49,9.4) v1(17.53,14.48) v1(17.53,13.46) v1(17.53,12.45) v1(17.55,11.43) v1(17.55,10.41) v1(17.55,9.4) v1(17.8,8) v1(17.8,6.99) v1(17.8,5.97) v1(17.8,4.95) v1(17.8,3.94) v1(18.54,14.48) v1(18.54,13.46) v1(18.54,12.45) v1(18.57,11.43) v1(18.57,10.41) v1(18.57,9.4) v1(18.81,16.13) v1(18.81,8) v1(18.81,6.99) v1(18.81,5.97) v1(18.81,4.95) v1(18.81,3.94) v1(19.83,16.13) v1(19.83,15.11) v1(19.83,14.1) v1(19.83,13.08) v1(19.83,12.07) v1(19.83,11.05) v1(19.83,10.03) v1(19.83,9.02) v1(19.83,8) v1(19.83,6.99) v1(19.83,5.97) v1(19.83,4.95) v1(19.83,3.94) v1(20.84,16.13) v1(20.84,15.11) v1(20.84,14.1) v1(20.84,13.08) v1(20.84,12.07) v1(20.84,11.05) v1(20.84,10.03) v1(20.84,9.02) v1(20.84,8) v1(20.84,6.99) v1(20.84,5.97) v1(20.84,4.95) v1(20.84,3.94) v1(21.86,8) v1(21.86,6.99) v1(21.86,5.97) v1(21.86,4.95) v1(21.86,3.94) v1(22.88,8) v1(22.88,6.99)
VCCCAM: length 10.8
  Top Layer w0.762: H2.1 17.58,54.28 C16.2
  Top Layer w0.889: R21.1 16.02,50.32 C15.1 19.52,50.3 U5.5
VCCSTEER: length 42.6
  Top Layer w0.762: C3.1 4.83,41.66 1.27,45.21 1.27,53.85 2.03,54.61 6.73,54.61 7.49,55.37 H10.2
  Top Layer w1.016: 4.83,37.72 7.81,37.72 C4.2
  Top Layer w1.27: 1.77,33.02 1.77,34.67 4.83,37.72 C3.1 9.78,40.64 9.9,40.52 R11.2
00.0: length 19
  Bottom Layer w0.254: U1.99 37.85,42.29 41.4,45.85 41.4,51.63 H2.16
00.1: length 16.8
  Inner1 w0.254: U1.100 36.32,43.56 36.32,50.67 34.54,52.45 34.54,55.95 H2.14
00.2: length 21.7
  Inner1 w0.254: H2.12 32,55.95 32,52.98 33.66,51.33 33.66,41.4 33.91,41.15 36.2,41.15 U1.101
00.3: length 20.9
  Inner1 w0.254: H2.10 29.46,55.95 29.46,53.98 33.02,50.42 33.02,40.89 34.16,39.75 U1.102
00.4: length 26.3
  Inner1 w0.254: U1.103 36.32,38.48 34.16,38.48 32.39,40.26 32.39,48.26 26.92,53.72 26.92,55.95 H2.8
00.5: length 27.3
  Inner1 w0.254: H2.6 24.38,55.95 24.38,53.34 24.64,53.09 26.8,53.09 31.88,48.01 31.88,38.61 32.77,37.72 34.54,37.72 U1.104
00.6: length 34.6
  Top Layer w0.254: H2.4 21.84,55.95 21.84,53.72 22.61,52.96 29.34,52.96 33.53,48.77 33.53,36.96 34.54,35.94 36.32,35.94 U1.105
00.7: length 34.9
  Inner2 w0.254: U1.106 32.51,37.21 32.51,50.04 29.85,52.71 20.83,52.71 19.3,54.23 19.3,55.95 H2.2
02.0: length 27.9
  Inner2 w0.254: H2.5 24.58,53.21 30.61,53.21 33.4,50.42 33.4,46.99 34.16,46.23 41.15,46.23 41.53,46.61 41.53,48.77 U1.90
02.1: length 9.6
  Top Layer w0.254: H2.15 35.78,54.2
  Inner1 w0.254: U1.91 38.99,48.51 38.99,51.5 H2.15
02.2: length 16.9
  Inner2 w0.254: U1.92 40.13,53.09 37.21,56.01 29.46,56.01 H2.9
02.3: length 12.1
  Inner1 w0.254: 30.7,53.94 H2.11
  Inner2 w0.254: H2.11 33.85,51.56 35.81,51.56 36.32,51.05 36.32,48.64 U1.93
02.6: length 73
  Top Layer w0.254: v1(80.52,23.75) 79.88,23.75 78.23,25.4 78.23,30.99 74.93,34.29 74.93,38.35 69.72,43.56 36.7,43.56 36.32,43.94 36.32,48.64 U1.96
  Inner1 w0.254: v1(80.52,23.75) 86.73,23.75 v1(88.18,22.29)
02.7: length 70.5
  Inner1 w0.254: v1(88.27,15.23) 85.22,18.28 85.22,19.81 84.33,20.7 80.26,20.7 77.47,23.5 77.47,30.35 74.17,33.66 74.17,38.1 67.44,44.83 U1.97
10.1: length 76.4
  Top Layer w0.254: R9.4 88.14,2.67 88.14,4.83 86.87,6.1 86.87,18.54 85.22,20.19 85.22,23.88 84.2,24.89 81.92,24.89 79.88,26.92 79.88,31.88 77.34,34.42 77.34,37.97 70.61,44.7 50.42,44.7 U1.85
10.2: length 43.9
  Inner1 w0.254: U1.86 49.02,48.64 81.79,48.64 82.04,48.9 82.04,51.69 81.79,51.94 81.79,56.01 H8.4
10.3: length 74.9
  Top Layer w0.254: R9.3 86.11,4.7 86.11,18.42 84.71,19.81 84.71,23.24 83.69,24.26 81.66,24.26 79.12,26.8 79.12,31.75 76.71,34.16 76.71,37.85 70.48,44.07 48.26,44.07 45.21,47.12 U1.87
10.5: length 38
  Top Layer w0.254: H8.1 79.38,53.59 47.63,53.59 45.21,51.18 U1.88
10.6: length 45
  Top Layer w0.254: U1.89 43.94,48.64 45.97,48.64 46.61,49.28 46.61,51.31 48.26,52.96 81.92,52.96 83.06,54.1 H8.3
11.2: length 48
  Top Layer w0.254: U1.78 56.64,48.64 54.36,48.64 54.1,48.39 54.1,46.36 55.12,45.34 70.87,45.34 77.98,38.23 77.98,34.54 81.03,31.5 81.03,27.7 R22.2
11.3: length 34.9
  Top Layer w0.254: U1.79 56.9,45.85 71.12,45.85 78.61,38.35 81.79,38.35 82.04,38.1 82.04,34.81 R24.2
11.6: length 37
  Top Layer w0.254: U1.80 57.66,52.2 83.02,52.2 84.33,53.5 84.33,55.5 84.71,55.88 86.74,55.88 H8.8
15.0: length 30.5
  Bottom Layer w0.254: 57.91,56.9 57.91,53.21 59.31,51.82 81.41,51.82 U1.58
15.1: length 32.7
  Bottom Layer w0.254: U1.59 79.58,48.57 75.01,48.57 74.42,49.15 74.42,50.8 73.91,51.31 57.15,51.31 55.5,52.96 H1.5
15.2: length 26.3
  Inner1 w0.254: H1.7 60.58,51.82 61.09,51.31 79.38,51.31 U1.60
15.3: length 39.7
  Bottom Layer w0.254: H1.3 51.69,55.88 51.69,45.85 52.58,44.96 75.82,44.96 U1.61
15.4: length 18.1
  Inner2 w0.254: H1.8 67.95,52.32 75.82,52.32 U1.62
15.5: length 34.5
  Bottom Layer w0.254: H1.4 53.98,56.13 53.98,46.23 54.74,45.47 74.42,45.47 75.69,46.74 U1.63
20.6: length 7.2
  Top Layer w0.254: R16.2 81.79,31.5 80.77,32.51 U1.49
20.7: length 8.5
  Top Layer w0.254: U1.50 83.57,36.96 83.57,29.84 R19.2
20.11: length 78.1
  Inner2 w0.254: H15.3 52.83,1.78 59.31,8.25 59.31,12.7 60.96,14.35 74.93,14.35 77.98,17.4 77.98,45.21 79.38,46.61 79.38,48.13 80.01,48.77 84.2,48.77 84.45,48.51 84.45,43.43 U1.54
20.12: length 61.7
  Inner2 w0.254: U1.55 79.5,43.56 79.5,8 78.99,7.49 64.01,7.49 57.91,1.4
20.13: length 62.4
  Inner2 w0.254: U1.56 82.04,43.56 82.04,6.73 81.79,6.48 65.53,6.48 H15.6
20.14: length 67.2
  Inner2 w0.254: U1.57 82.8,47.37 81.53,46.1 80.14,46.1 78.87,44.83 78.87,15.37 77.09,13.59 62.48,13.59 61.72,12.83 61.72,8.13 55.37,1.78 55.37,1.4
21.2: length 19.1
  Top Layer w0.254: U1.38 79.5,10.54 79.5,8.51 78.99,8 78.36,8 76.07,5.72 68.33,5.72 66.56,3.95 R3.1
21.3: length 16.6
  Top Layer w0.254: U1.39 81.41,7.37 78.74,7.37 76.45,5.08 70.36,5.08 69.48,4.2 R5.2
21.4: length 18
  Top Layer w0.254: R6.1 73.41,4.57 76.96,4.57 79.25,6.86 82.8,6.86 84.58,8.64 84.58,10.54 U1.40
21.5: length 17.8
  Top Layer w0.254: U1.41 85.22,12.45 85.22,7.24 84.2,6.22 79.49,6.22 R7.2
33.6: length 38.4
  Top Layer w0.254: R8.4 35.31,2.67 35.31,4.83 36.96,6.48 62.23,6.48 64.39,8.64 64.39,10.41 U1.24
33.7: length 31.5
  Top Layer w0.254: R8.3 38.48,5.84 62.74,5.84 65.53,8.64 U1.25
33.9: length 104.5
  Bottom Layer w0.254: v1(13.97,57.4) 13.97,52.71 14.48,52.2 30.99,52.2 32,51.18 32,7.49 32.77,6.73 65.53,6.73 U1.27
33.10: length 14.3
  Top Layer w0.254: R4.1 62.12,22.09 R2.1 63.63,20.05 64.38,19.3 66.8,19.3 68.07,18.03 U1.28
A5: length 98.2
  Bottom Layer w0.254: U1.16 54.1,10.54 69.09,10.54 69.34,10.29 69.34,6.99 70.48,5.84 83.95,5.84 86.23,8.13 86.23,50.42 83.57,53.09 75.06,53.09 73.41,54.74 H4.2
$1N29869: length 2.9
  Top Layer w0.254: R6.2 73.91,3.29 H12.3
$1N29872: length 2.6
  Top Layer w0.254: R3.2 68.06,2.53 H12.1
$1N29873: length 2.8
  Top Layer w0.254: R5.1 70.98,2.91 H12.2
$1N29874: length 2.5
  Top Layer w0.254: R7.1 75.32,2.17 H12.4
$1N29879: length 6.7
  Top Layer w0.254: R1.2 61.98,29.98 BEEP1.1
$1N29880: length 8.8
  Top Layer w0.254: Q1.3 67.18,21.35 BEEP1.2
$1N29881: length 1.6
  Top Layer w0.254: R2.2 64.97,22.09 Q1.1
$1N29892: length 2.5
  Top Layer w0.762: H10.3 12.2,57.15 R13.1
$1N29897: length 2
  Top Layer w0.889: 14.17,48.28 14.65,48.75 R21.2
$1N29902: length 1.9
  Top Layer w0.889: R12.2 15.59,45.94 14.22,45.94
$1N29905: length 12.1
  Top Layer w1.524: SW1.2 6.1,20.19 6.1,16.13 8.01,14.21 Q2.1
$1N29906: length 5.3
  Top Layer w0.889: SW1.3 5.76,27.69 D3.2
$1N29908: length 1.7
  Top Layer w0.889: R29.2 19.55,30.55 19.22,30.23 U6.4
$1N29909: length 3
  Top Layer w0.889: 19.49,26.04 17.7,24.26 C17.1
$1N29910: length 11.4
  Top Layer w0.889: v1(15.87,24.26) 15.67,24.26 13.89,26.04
  Bottom Layer w1.016: v1(24.51,24.26) v1(15.87,24.26)
$1N29911: length 2.4
  Top Layer w0.762: R31.2 11.55,28.96 13.58,28.96
$1N29912: length 1.6
  Top Layer w0.762: 11.3,31.81 R31.1
$1N29913: length 1.8
  Top Layer w0.889: R28.2 14.99,33.27 R26.1
$1N29914: length 2.3
  Top Layer w0.762: R27.1 19.94,32.89 20.33,32.89 21.21,32.01 21.34,32.01
$1N29916: length 21.4
  Top Layer w0.889: v1(15.7,37.59) 13.4,37.59 ; 13.4,37.59 13.4,37.59 C18.2 ; 13.4,37.59 C20.2
  Top Layer w1.016: 24.38,38.1 L2.2
  Bottom Layer w1.27: 24.38,38.1 23.88,37.59 v1(15.7,37.59)
$1N29918: length 3.5
  Top Layer w0.889: R32.2 14.99,31.76 R28.1 13.25,31.72 13.25,30.56 U6.5
$1N29920: length 26.5
  Top Layer w0.762: C21.1 22.61,20.19 C23.2 21.59,26.56 20.46,27.69 U6.2 ; C21.1 27.86,19.25 27.86,15.35 ; C21.1 29.08,22.35 C22.2
  Top Layer w0.889: U6.2 19.18,28.96
$1N29921: length 1.8
  Top Layer w0.762: R18.1 21.53,19.36 C12.2
$1N29922: length 2
  Top Layer w1.016: R11.1 LED2.2
$1N29924: length 12.2
  Top Layer w1.016: R10.1 5.21,44.95 5.21,47.63 PR1.2 PR1.3
$1N29926: length 37.9
  Top Layer w0.762: v1(18.42,17.27) 18.42,18.29 v1(18.17,18.54)
  Bottom Layer w0.762: PR1.1 10.54,39.79 10.54,23.88 15.88,18.54 v1(18.17,18.54)
$1N29927: length 18.2
  Top Layer w0.635: 9.65,25.91 10.54,25.91 13.21,23.24 17.28,23.24 U4.8
  Top Layer w0.889: L1.1 9.65,31.12 9.65,25.91
$1N29928: length 3.8
  Top Layer w0.889: C1.1 11.81,22.35 U4.1
$1N29929: length 1.9
  Top Layer w0.762: U4.6 19.57,19.81 R18.2
$1N29930: length 1.8
  Top Layer w0.889: U4.4 12.57,18.18 R14.1
$1N29955: length 19.3
  Top Layer w1.778: Q2.3 6.68,9.67 CON3.2 2.79,17.78 SW1.1
  Bottom Layer w0.889: v1(7.75,22.35) 7.37,22.35 SW1.1
$1N29989: length 8.1
  Top Layer w0.254: R16.1 85.47,32.64 85.47,37.34 SW7.1
$1N29991: length 5.8
  Top Layer w0.254: R19.1 84.32,29.71 86.74,32.13 SW2.1
$1N29992: length 4.3
  Top Layer w0.254: R22.1 86.74,28.32 SW3.1
$1N29994: length 10.5
  Top Layer w0.254: R24.1 84.96,34.68 84.96,42.16 85.85,43.05 SW4.1
$1N51563: length 2.1
  Top Layer w0.254: 90.3,23.88 90.26,23.84 R35.1
$1N51564: length 2.5
  Top Layer w0.254: R34.1 89.16,13.72 H5.3

## Copper pours and planes (outline as drawn; the poured copper is in the pictures)
GNDBAT on Top Layer: -9.52,65.13 109.09,65.13 109.09,-14.6 -9.52,-14.6
GNDBAT on Bottom Layer: -18.54,70.36 123.19,70.36 123.19,-30.73 -18.54,-30.73
VCC3V3 on Top Layer: 15.17,44.78 21.97,44.78 21.97,42.16 15.17,42.16
VCC3V3 on Inner1: -10.8,67.69 104.9,67.69 104.9,-6.86 -10.8,-6.86
VCC5V5 on Inner2: -24.13,80.9 135.76,80.9 135.76,-43.43 -24.13,-43.43
VCCBAT on Top Layer: 13.79,21.72 13.79,19.38 13.59,19.18 11.56,19.18 11.43,19.05 11.43,17.06 11.93,16.57 14.04,16.57 15.94,16.14 18.09,16.61 24.07,16.61 24.07,10.99 23.62,10.54 23.62,0.89 12.16,0.89 12.19,7.66 12.19,7.75 11.94,9.42 11.94,14.48 10.89,15.53 8.35,15.53 7.75,16.13 7.75,21.08 8.38,21.72

Small or netless copper shapes (teardrops, artwork), in the pictures only: 107 on Bottom Layer, 120 on Top Layer, 16 on Inner1, 18 on Inner2

## Text on the board
Top Layer: 2024.5.20 | 海南师范大学 | 碱基互补配队
Top Silkscreen Layer: GND | VCC | 编码器1 | 摄像头 | 陀螺仪 | 屏幕 | 磁铁 | 激光 | 电机接口 | 编码器2 | 蓝牙/图传 | 无线串口/ | 按键 | 无刷电调
